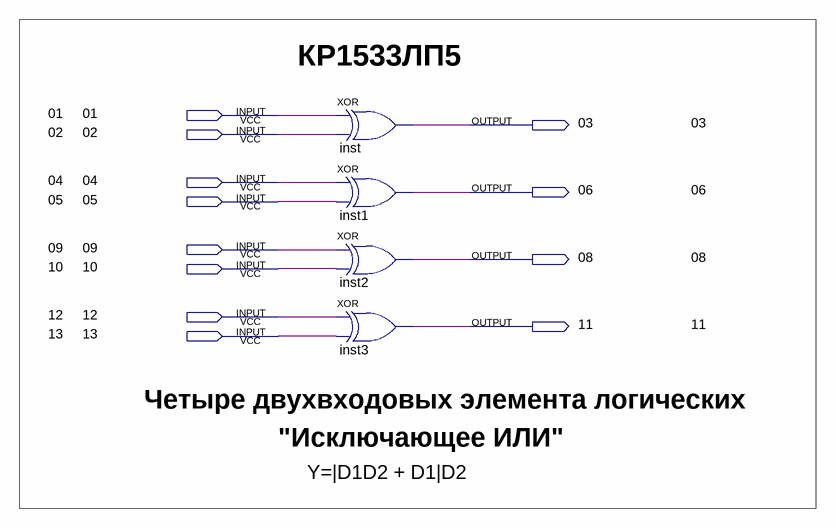
[diagram p0: schematic sheet]
// Quartus schematic KP1533LP5.bdf as structural Verilog: 4 symbols, 12 pins
module KP1533LP5 (
  input  \01 ,
  input  \02 ,
  input  \04 ,
  input  \05 ,
  input  \09 ,
  input  \10 ,
  input  \12 ,
  input  \13 ,
  output \03 ,
  output \06 ,
  output \08 ,
  output \11 
);

  xor inst (\03 , \01 , \02 );
  xor inst1 (\06 , \04 , \05 );
  xor inst2 (\08 , \09 , \10 );
  xor inst3 (\11 , \12 , \13 );

  // Notes on the sheet:
  //   КР1533ЛП5
  //   01
  //   03
  //   02
  //   04
  //   06
  //   05
  //   09
  //   08
  //   10
  //   12
  //   11
  //   13
  //   Четыре двухвходовых элемента логических
  //   "Исключающее ИЛИ"
  //   Y=|D1D2 + D1|D2
endmodule
